# EasyEDA schematic AGRIBOT.json
TITLE: AGRI-BOT; REV: 10.11; Date: 2019-10-14; Sheet: 1/1; Company: VIT-AP EC Project
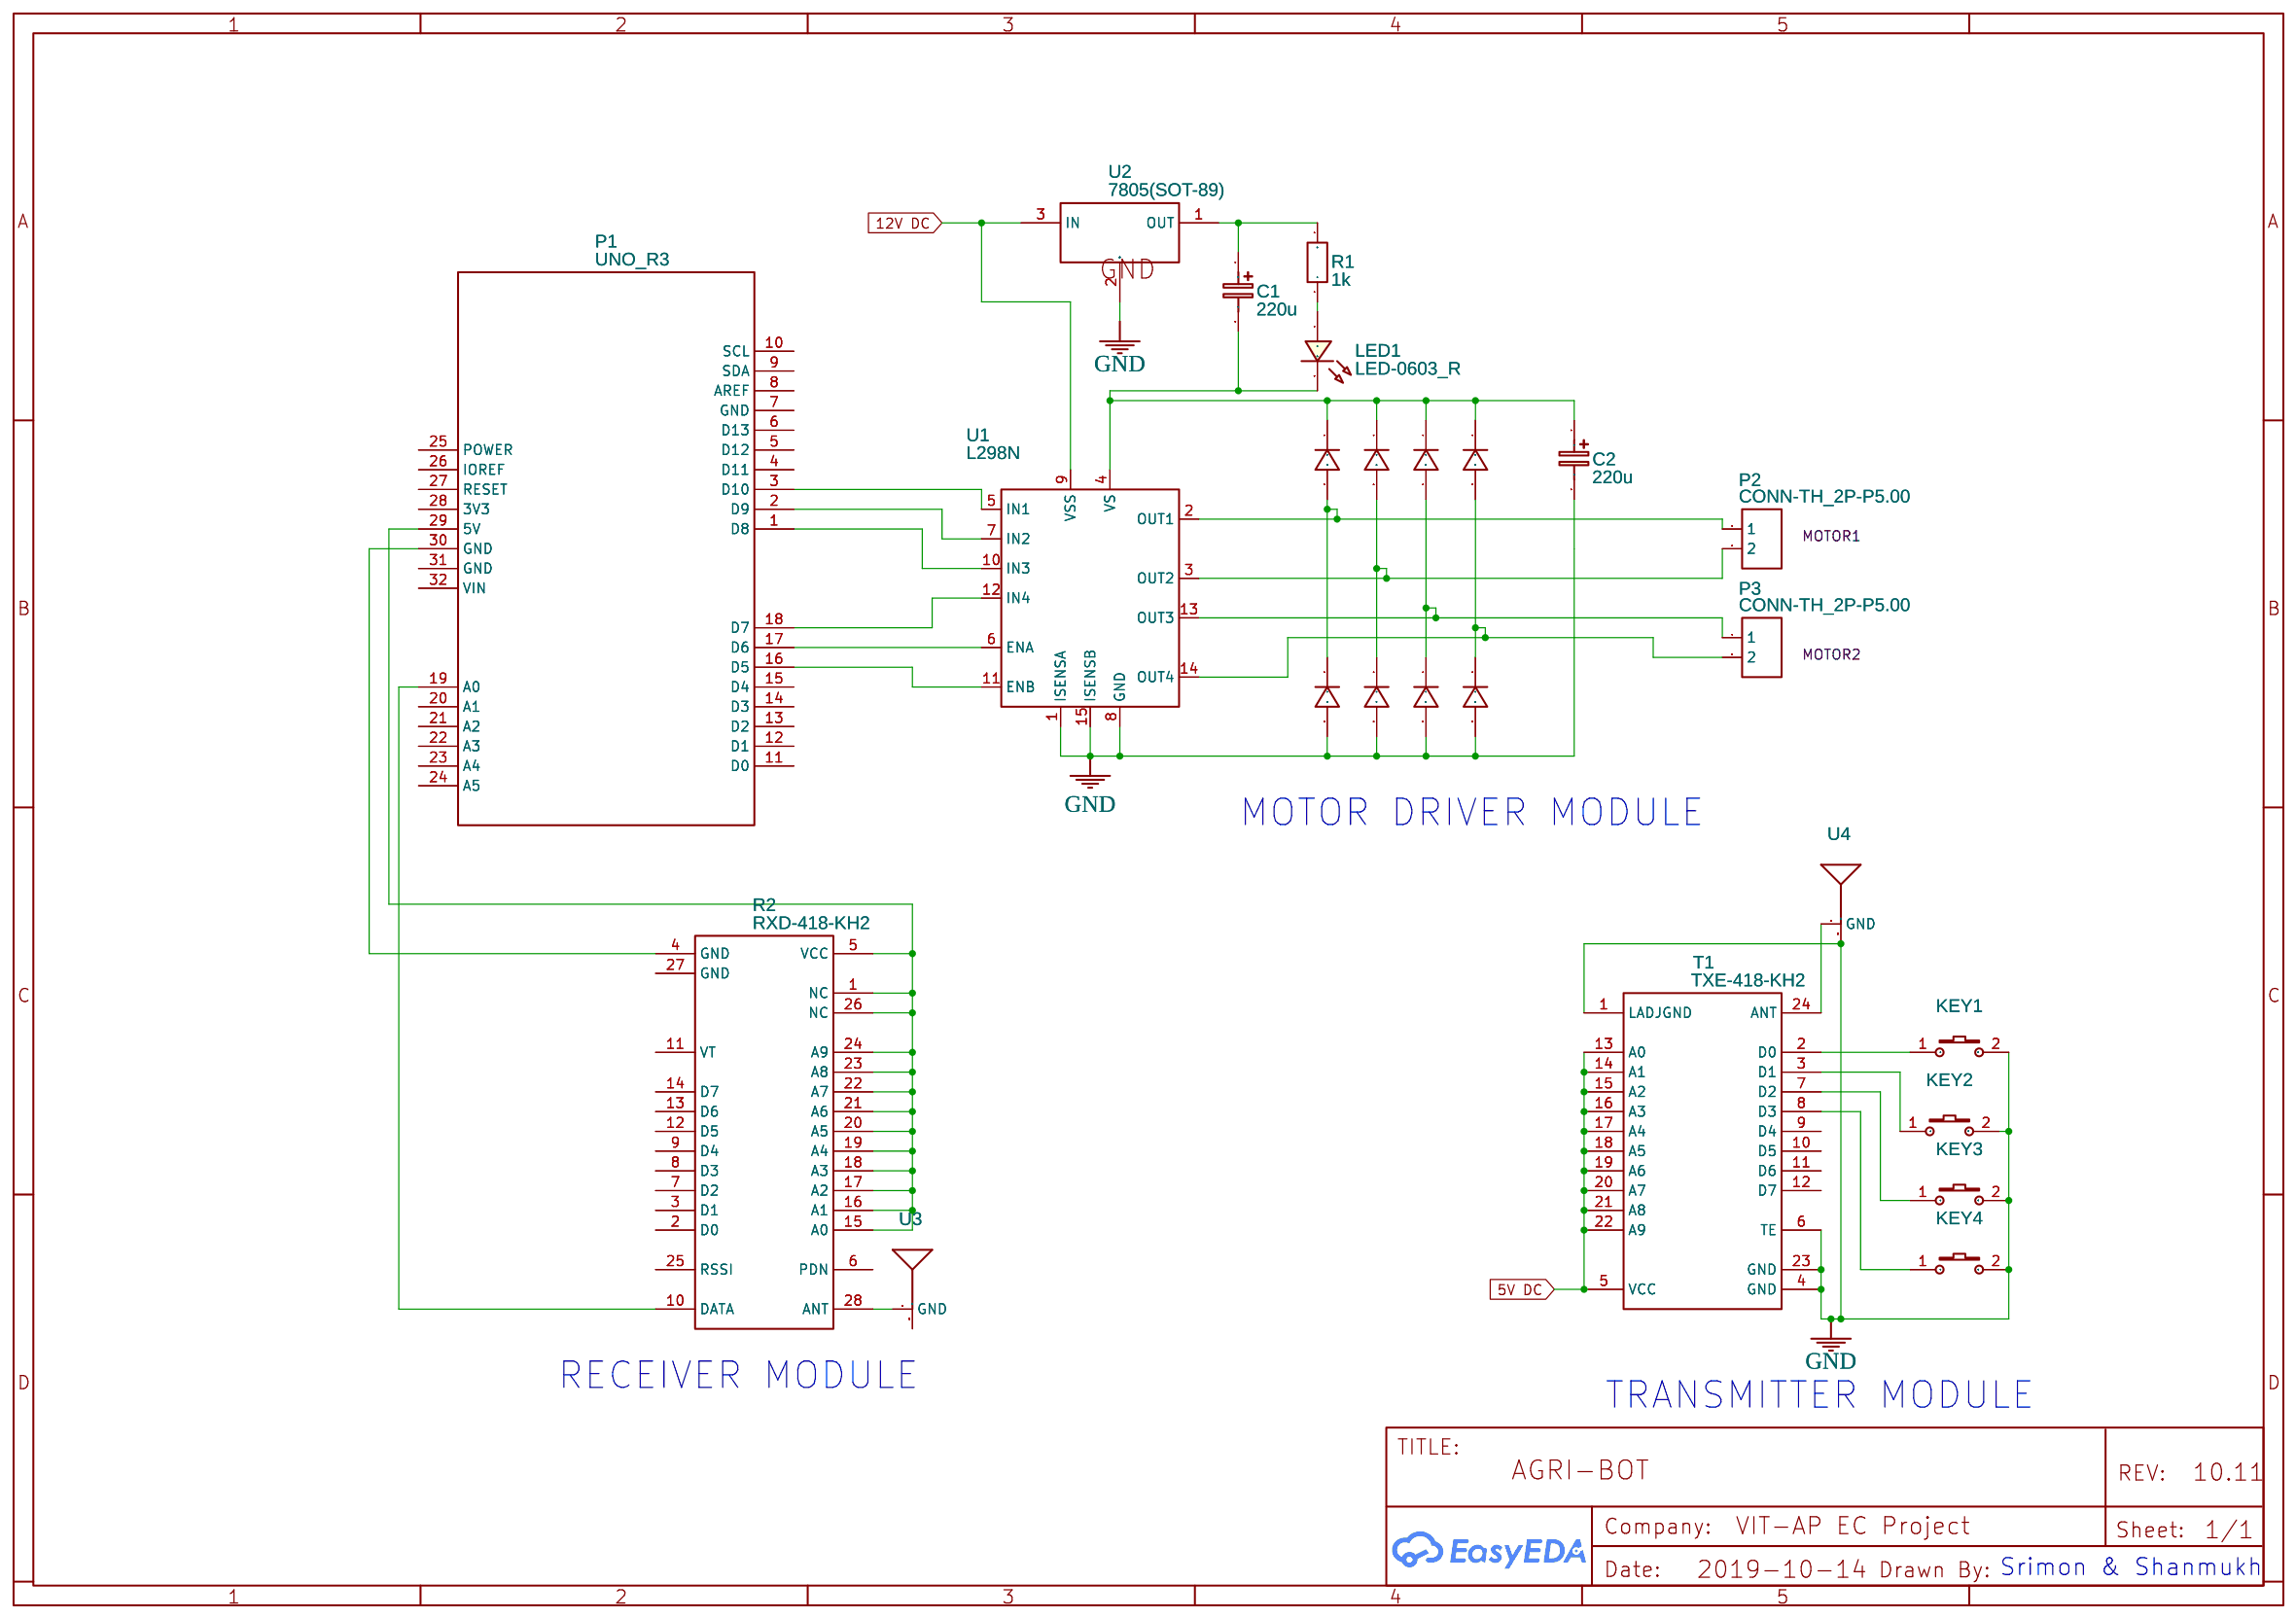
[diagram p0: schematic sheet]

## Parts
C1  220u  [CASE-A_3216]
C2  220u  [CASE-A_3216]
D1  1N4007W  [SOD-123_L2.8-W1.8-LS3.7-RD]
D2  1N4007W  [SOD-123_L2.8-W1.8-LS3.7-RD]
D3  1N4007W  [SOD-123_L2.8-W1.8-LS3.7-RD]
D4  1N4007W  [SOD-123_L2.8-W1.8-LS3.7-RD]
D5  1N4007W  [SOD-123_L2.8-W1.8-LS3.7-RD]
D6  1N4007W  [SOD-123_L2.8-W1.8-LS3.7-RD]
D7  1N4007W  [SOD-123_L2.8-W1.8-LS3.7-RD]
D8  1N4007W  [SOD-123_L2.8-W1.8-LS3.7-RD]
KEY1  K2-3.6×6.1_SMD  [KEY-SMD_2P-L6.2-W3.6-LS8.0]
KEY2  K2-3.6×6.1_SMD  [KEY-SMD_2P-L6.2-W3.6-LS8.0]
KEY3  K2-3.6×6.1_SMD  [KEY-SMD_2P-L6.2-W3.6-LS8.0]
KEY4  K2-3.6×6.1_SMD  [KEY-SMD_2P-L6.2-W3.6-LS8.0]
LED1  LED-0603_R  [LED0603_RED]
P1  UNO_R3  [UNO_R3]
P2  CONN-TH_2P-P5.00  [CONN-TH_2P-P5.00]
P3  CONN-TH_2P-P5.00  [CONN-TH_2P-P5.00]
R1  1k  [R0603]
R2  RXD-418-KH2  [LMD0.63-28]
T1  TXE-418-KH2  [LMD0.63-24]
U1  L298N
U2  7805(SOT-89)  [SOT-89-3_L4.5-W2.5-P1.50-LS4.2-BR]
U3  ANTENNA-GND24GHZ  [ANTENNA-24GHZ-PCB]
U4  ANTENNA-GND24GHZ  [ANTENNA-24GHZ-PCB]

## Library data of the parts
C1 C2 = C_Tan_SMD_A_EU: Contributor: LCEDA_Lib
D1-D8 = 1N4007W: Supplier: LCSC; Supplier Part: C328592; Manufacturer: BLUE ROCKET; Contributor: LCEDA_Lib
KEY1-KEY4 = K2-3.6×6.1_SMD: Supplier Part: C118141; Supplier: LCSC; Manufacturer Part: K2-1107ST-A4SW-06; Contributor: LCEDA_Lib; 制造商: 韩国韩荣
LED1 = LED-0603_R: Manufacturer: EVERLIGHT(台湾亿光); Manufacturer Part: 19-217/R6C-AL1M2VY/3T; Supplier Part: C72044; Supplier: LCSC; Contributor: LCEDA_01
P1 = UNO_R3: sourceId: 1T5FDZYC8
P2 P3 = CONN-TH_2P-P5.00: Supplier: LCSC; Contributor: LCEDA_Lib
R1 = R_0603_EU: Contributor: LCEDA_Lib
R2 = RXD-418-KH2: RF Receiver with Integrated Decoder Module, KH2 Series, 418MHz, SMD
T1 = TXE-418-KH2: RF Transmitter with Integrated Encoder Module, KH2 Series, 418MHz, SMD
U1 = L298N
U2 = 7805(SOT-89): Supplier: LCSC; Manufacturer: CJ; Manufacturer Part: CJ78L05; image: //image.lceda.cn/szlcsc/C2079.jpg; Supplier Part: C2079; LCSC Assembly: Yes; SMT Type: Extend; Contributor: LCEDA_Lib
U3 U4 = ANTENNA-GND24GHZ: Pulse W3008C; Contributor: Pinoccio

## Nets
5V DC: T1.5(VCC) T1.13(A0) T1.14(A1) T1.15(A2) T1.16(A3) T1.17(A4) T1.18(A5) T1.19(A6) T1.20(A7) T1.21(A8) T1.22(A9)
12V DC: U1.9(VSS) U2.3(IN)
GND: C2.2 D2.2 D6.2 D7.2 D8.2 KEY1.2 KEY2.2 KEY3.2 KEY4.2 T1.1(LADJGND) T1.4(GND) T1.6(TE) T1.23(GND) U1.1(ISENSA) U1.8(GND) U1.15(ISENSB) U2.2(GND) U4.FEED(SIGNAL)
Net-(C1-1): C1.1 R1.2 U2.1(OUT)
Net-(C1-2): C1.2 C2.1 D1.1 D3.1 D4.1 D5.1 LED1.2 U1.4(VS)
Net-(D1-2): D1.2 D2.1 P2.1 U1.2(OUT1)
Net-(D3-2): D3.2 D6.1 P2.2 U1.3(OUT2)
Net-(D4-2): D4.2 D7.1 P3.1 U1.13(OUT3)
Net-(D5-2): D5.2 D8.1 P3.2 U1.14(OUT4)
Net-(KEY1-1): KEY1.1 T1.2(D0)
Net-(KEY2-1): KEY2.1 T1.3(D1)
Net-(KEY3-1): KEY3.1 T1.7(D2)
Net-(KEY4-1): KEY4.1 T1.8(D3)
Net-(LED1-1): LED1.1 R1.1
Net-(P1-1): P1.1(D8) U1.10(IN3)
Net-(P1-2): P1.2(D9) U1.7(IN2)
Net-(P1-3): P1.3(D10) U1.5(IN1)
Net-(P1-16): P1.16(D5) U1.11(ENB)
Net-(P1-17): P1.17(D6) U1.6(ENA)
Net-(P1-18): P1.18(D7) U1.12(IN4)
Net-(P1-19): P1.19(A0) R2.10(DATA)
Net-(P1-29): P1.29(5V) R2.1(NC) R2.5(VCC) R2.15(A0) R2.16(A1) R2.17(A2) R2.18(A3) R2.19(A4) R2.20(A5) R2.21(A6) R2.22(A7) R2.23(A8) R2.24(A9) R2.26(NC)
Net-(P1-30): P1.30(GND) R2.4(GND)
Net-(R2-28): R2.28(ANT) U3.GND
Net-(T1-24): T1.24(ANT) U4.GND

Not connected (* = marked no-connect by the designer): P1 4(D11) 5(D12) 6(D13) 7(GND) 8(AREF) 9(SDA) 10(SCL) 11(D0) 12(D1) 13(D2) 14(D3) 15(D4) 20(A1) 21(A2) 22(A3) 23(A4) 24(A5) 25(POWER) 26(IOREF) 27(RESET) 28(3V3) 31(GND) 32(VIN); R2 2(D0) 3(D1) 6(PDN) 7(D2) 8(D3) 9(D4) 11(VT) 12(D5) 13(D6) 14(D7) 25(RSSI) 27(GND); T1 9(D4) 10(D5) 11(D6) 12(D7); U3 FEED(SIGNAL)

## Notes on the sheet
- MOTOR DRIVER MODULE
- RECEIVER MODULE
- TRANSMITTER MODULE
- Srimon & Shanmukh
